# EAGLE schematic krokomerSTMa (EAGLE 9.6.2)
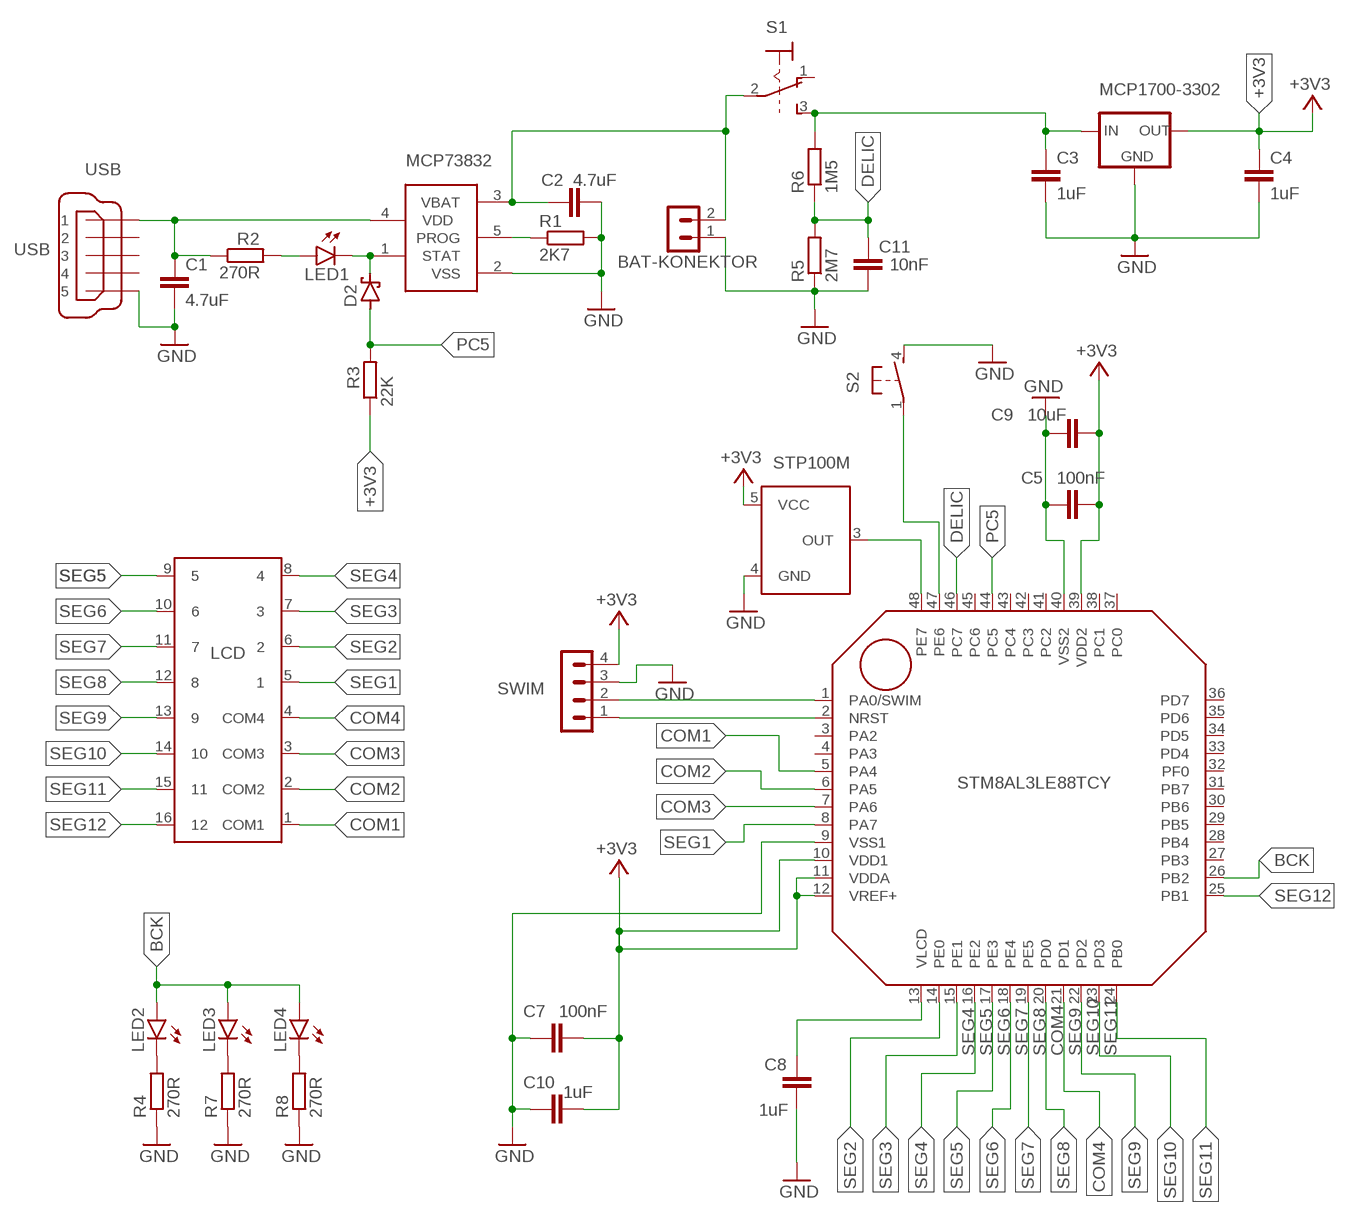
[diagram p0: schematic, sheet 1]

## Parts
BAT-KONEKTOR  PSH02-02P  [PSH02-02P]
C1  4.7uF  C-EUC0603  [C0603]
C2  4.7uF  C-EUC0603  [C0603]
C3  1uF  C-EUC0603  [C0603]
C4  1uF  C-EUC0603  [C0603]
C5  100nF  C-EUC0603  [C0603]
C7  100nF  C-EUC0603  [C0603]
C8  1uF  C-EUC0603  [C0603]
C9  10uF  C-EUC0805  [C0805]
C10  1uF  C-EUC0603  [C0603]
C11  10nF  C-EUC0603  [C0603]
D2  BAT60J  [SOD323_ST]
LED1  LEDCHIPLED_0805  [CHIPLED_0805]
LED2  LEDCHIPLED_0805  [CHIPLED_0805]
LED3  LEDCHIPLED_0805  [CHIPLED_0805]
LED4  LEDCHIPLED_0805  [CHIPLED_0805]
MCP1700  MCP1700-3302  MCP1700  [SOT23]
MCP73832  MCP73831  [SOT23-5L]
R1  2K7  R-EU_R0805  [R0805]
R2  270R  R-EU_R0805  [R0805]
R3  22K  R-EU_R0805  [R0805]
R4  270R  R-EU_R0805  [R0805]
R5  2M7  R-EU_R0805  [R0805]
R6  1M5  R-EU_R0805  [R0805]
R7  270R  R-EU_R0805  [R0805]
R8  270R  R-EU_R0805  [R0805]
S1  PREPINAC  [PREPINAC]
S2  TLACITKO  [DTSM-6]
STM8AL3LE88  STM8AL3LE  [TQFP48]
SWIM  S1G4_JUMP  [S1G4_JUM]
U$1  LCD16  [LCD16]
U$2  STP100M  [STP100M]
USB  USB  MINI-USB-32005-301  [32005-301]

## Nets
+3V3: C4.1 C5.1 C7.1 C9.2 C10.1 MCP1700.2(OUT) R3.1 STM8AL3LE88.10(VDD1) STM8AL3LE88.11(VDDA) STM8AL3LE88.12(VREF+) STM8AL3LE88.39(VDD2) SWIM.4 U$2.5(VCC)
BCK: LED2.A LED3.A LED4.A STM8AL3LE88.26(PB2)
COM1: STM8AL3LE88.5(PA4) U$1.1(COM1)
COM2: STM8AL3LE88.6(PA5) U$1.2(COM2)
COM3: STM8AL3LE88.7(PA6) U$1.3(COM3)
COM4: STM8AL3LE88.21(PD1) U$1.4(COM4)
DELIC: C11.1 R5.2 R6.1 STM8AL3LE88.46(PC7)
GND: BAT-KONEKTOR.1 C1.2 C2.2 C3.2 C4.2 C5.2 C7.2 C8.2 C9.1 C10.2 C11.2 MCP1700.1(GND) MCP73832.2(VSS) R1.2 R4.1 R5.1 R7.1 R8.1 S2.4 STM8AL3LE88.9(VSS1) STM8AL3LE88.40(VSS2) SWIM.3 U$2.4(GND) USB.5
N$1: MCP73832.5(PROG) R1.1
N$2: LED1.A R2.2
N$3: D2.C LED1.C MCP73832.1(STAT)
N$4: C8.1 STM8AL3LE88.13(VLCD)
N$5: STM8AL3LE88.2(NRST) SWIM.1
N$6: STM8AL3LE88.1(PA0/SWIM) SWIM.2
N$7: S2.1 STM8AL3LE88.47(PE6)
N$8: LED2.C R4.2
N$9: STM8AL3LE88.48(PE7) U$2.3(OUT)
N$10: LED3.C R7.2
N$11: C3.1 MCP1700.3(IN) R6.2 S1.3(S)
N$12: LED4.C R8.2
N$28: C1.1 MCP73832.4(VDD) R2.1 USB.1
PC5: D2.A R3.2 STM8AL3LE88.44(PC5)
SEG1: STM8AL3LE88.8(PA7) U$1.5
SEG2: STM8AL3LE88.14(PE0) U$1.6
SEG3: STM8AL3LE88.15(PE1) U$1.7
SEG4: STM8AL3LE88.16(PE2) U$1.8
SEG5: STM8AL3LE88.17(PE3) U$1.9
SEG6: STM8AL3LE88.18(PE4) U$1.10
SEG7: STM8AL3LE88.19(PE5) U$1.11
SEG8: STM8AL3LE88.20(PD0) U$1.12
SEG9: STM8AL3LE88.22(PD2) U$1.13
SEG10: STM8AL3LE88.23(PD3) U$1.14
SEG11: STM8AL3LE88.24(PB0) U$1.15
SEG12: STM8AL3LE88.25(PB1) U$1.16
VCC: BAT-KONEKTOR.2 C2.1 MCP73832.3(VBAT) S1.2(P)
Unconnected: S1.1(O) STM8AL3LE88.3(PA2) STM8AL3LE88.4(PA3) STM8AL3LE88.27(PB3) STM8AL3LE88.28(PB4) STM8AL3LE88.29(PB5) STM8AL3LE88.30(PB6) STM8AL3LE88.31(PB7) STM8AL3LE88.32(PF0) STM8AL3LE88.33(PD4) STM8AL3LE88.34(PD5) STM8AL3LE88.35(PD6) STM8AL3LE88.36(PD7) STM8AL3LE88.37(PC0) STM8AL3LE88.38(PC1) STM8AL3LE88.41(PC2) STM8AL3LE88.42(PC3) STM8AL3LE88.43(PC4) STM8AL3LE88.45(PC6) USB.2 USB.3 USB.4

## Library data of the parts
BAT-KONEKTOR = PaJa_konektory:PSH02-02: Konektory se zamkem - vidlice - 2pin
C1-C5 C7-C11 = rcl:C-EU: CAPACITOR, European symbol; SPICEPREFIX: C
D2 = diode:BAT60J: Schottky barrier diode Source: www.st.com, BAT60J.pdf
LED1-LED4 = led:LED: LED OSRAM: - CHIPLED LG R971, LG N971, LY N971, LG Q971, LY Q971, LO R971, LY R971 LH N974, LH R974 LS Q976, LO Q976, LY Q976 LO Q996 - Hyper CHIPLED LW Q18S LB Q993, LB Q99A, LB R99A - SideLED LS A670, LO A670, LY A670, LG A670, LP A670 LB A673, LV A673, LT A673, LW A673 LH A674 LY A675 LS A676, LA A676, LO A676, LY A676, LW A676 LS A679, LY A679, LG A679 - Hyper Micro SIDELED® LS Y876, LA Y876, LO Y876, LY Y876 LT Y87S - SmartLED LW L88C, LW L88S LB L89C, LB L89S, LG L890 LS L89K, LO L89K, LY L89K LS L896, LA L896, LO L896, LY L896 - TOPLED LS T670, LO T670, LY T670, LG T670, LP T670 LSG T670, LSP T670, LSY T670, LOP T670, LYG T670 LG T671, LOG T671, LSG T671 LB T673, LV T673, LT T673, LW T673 LH T674 LS T676, LA T676, LO T676, LY T676, LB T676, LH T676, LSB T676, LW T676 LB T67C, LV T67C, LT T67C, LS T67K, LO T67K, LY T67K, LW E67C LS E67B, LA E67B, LO E67B, LY E67B, LB E67C, LV E67C, LT E67C LW T67C LS T679, LY T679, LG T679 LS T770, LO T770, LY T770, LG T770, LP T770 LB T773, LV T773, LT T773, LW T773 LH T774 LS E675, LA E675, LY E675, LS T675 LS T776, LA T776, LO T776, LY T776, LB T776 LHGB T686 LT T68C, LB T68C - Hyper Mini TOPLED® LB M676 - Mini TOPLED Santana® LG M470 LS M47K, LO M47K, LY M47K Source: http://www.osram.convergy.de LUXEON: - LUMILED® LXK2-PW12-R00, LXK2-PW12-S00, LXK2-PW14-U00, LXK2-PW14-V00 LXK2-PM12-R00, LXK2-PM12-S00, LXK2-PM14-U00 LXK2-PE12-Q00, LXK2-PE12-R00, LXK2-PE12-S00, LXK2-PE14-T00, LXK2-PE14-U00 LXK2-PB12-K00, LXK2-PB12-L00, LXK2-PB12-M00, LXK2-PB14-N00, LXK2-PB14-P00, LXK2-PB14-Q00 LXK2-PR12-L00, LXK2-PR12-M00, LXK2-PR14-Q00, LXK2-PR14-R00 LXK2-PD12-Q00, LXK2-PD12-R00, LXK2-PD12-S00 LXK2-PH12-R00, LXK2-PH12-S00 LXK2-PL12-P00, LXK2-PL12-Q00, LXK2-PL12-R00 Source: www.luxeon.com KINGBRIGHT: KA-3528ASYC Source: www.kingbright.com
MCP1700 = v-reg:MCP1700
MCP73832 = microchip-update:MCP73831: Miniature Single-Cell, Fully Integrated Li-Ion, Li-Polymer Charge Management Controllers
R1-R8 = rcl:R-EU_: RESISTOR, European symbol; SPICEPREFIX: R
S1 = prepinac:PREPINAC
S2 = switch-tact:TLACITKO
STM8AL3LE88 = stm32:STM8AL3LE
SWIM = PaJa_konektory:S1G4_JUMP: Radove konektory - koliky - 4x
U$1 = LCD:LCD16
U$2 = stp100m:STP100M
USB = con-cypressindustries:MINI-USB-: MINI USB-B Conector Source: www.cypressindustries.com; OC_FARNELL: unknown; OC_NEWARK: unknown